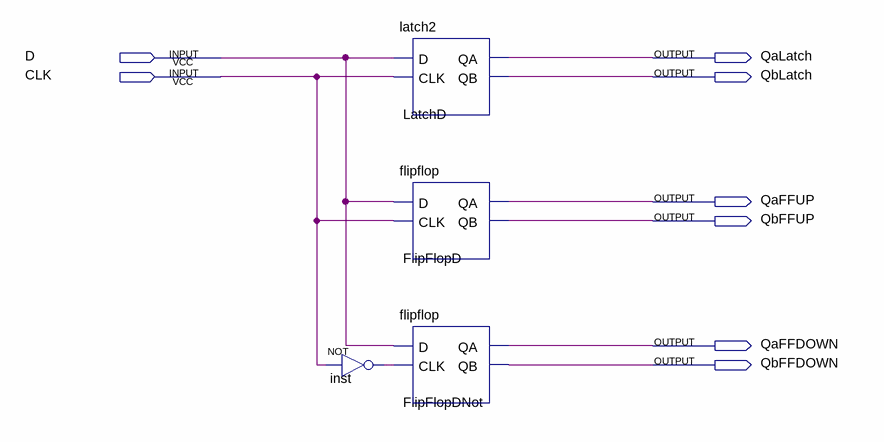
[diagram p0: schematic sheet]
// Quartus schematic part4.bdf as structural Verilog: 4 symbols, 8 pins
module part4 (
  input  D,
  input  CLK,
  output QaLatch,
  output QbLatch,
  output QaFFUP,
  output QbFFUP,
  output QaFFDOWN,
  output QbFFDOWN
);

  wire inst_out;

  not inst (inst_out, CLK);
  latch2 LatchD (.D(D), .CLK(CLK), .QA(QaLatch), .QB(QbLatch));
  flipflop FlipFlopD (.D(D), .CLK(CLK), .QA(QaFFUP), .QB(QbFFUP));
  flipflop FlipFlopDNot (.D(D), .CLK(inst_out), .QA(QaFFDOWN), .QB(QbFFDOWN));
endmodule
